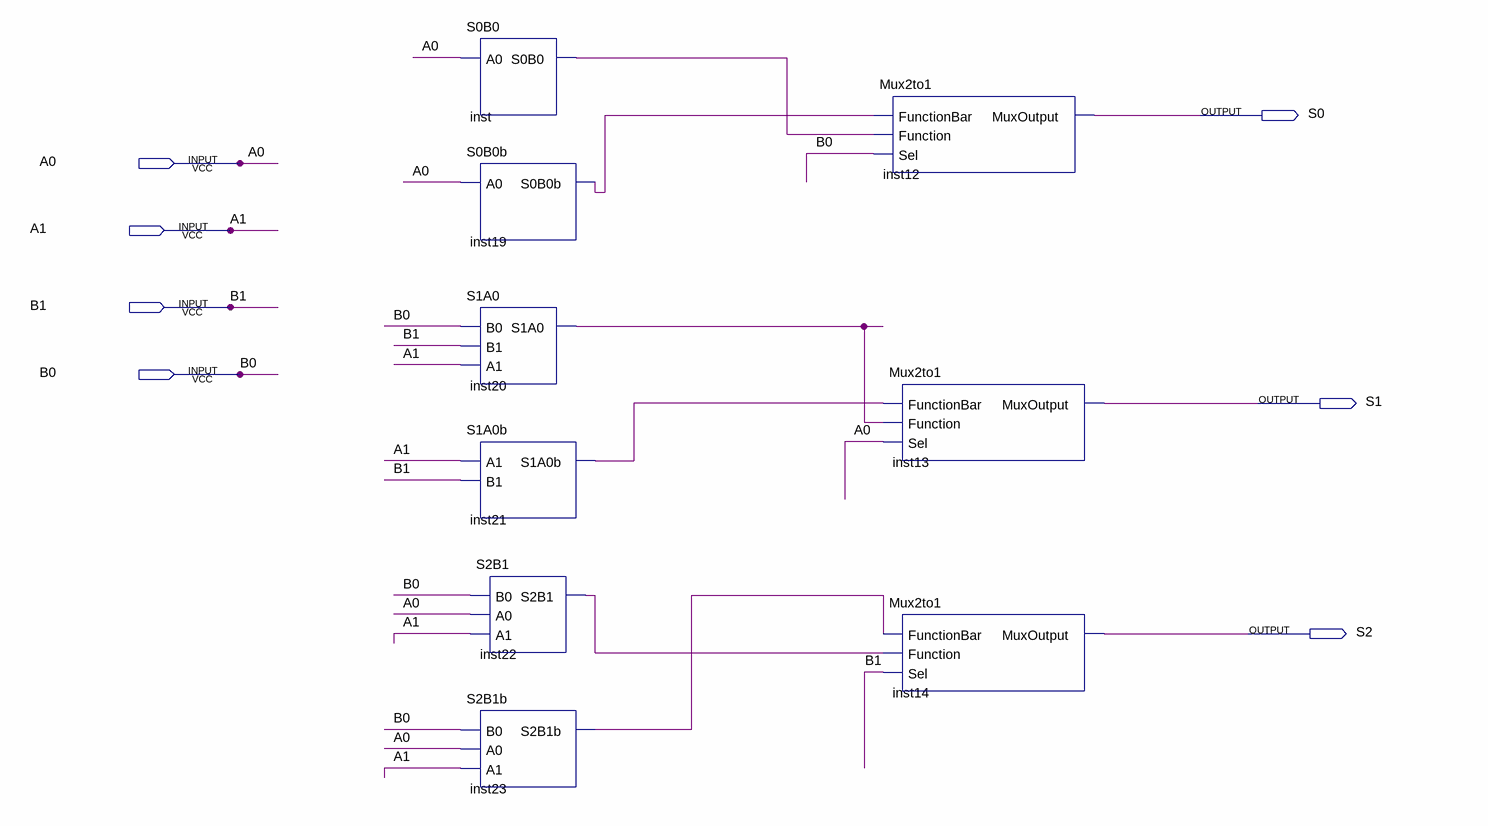
[diagram p0: schematic sheet]
// Quartus schematic Main.bdf as structural Verilog: 9 symbols, 7 pins
module Main (
  input  A0,
  input  A1,
  input  B1,
  input  B0,
  output S0,
  output S1,
  output S2
);

  wire inst19_s0b0b, inst20_s1a0, inst21_s1a0b, inst22_s2b1, inst23_s2b1b, inst_s0b0;

  S0B0 inst (.A0(A0), .S0B0(inst_s0b0));
  S0B0b inst19 (.A0(A0), .S0B0b(inst19_s0b0b));
  S1A0 inst20 (.B0(B0), .B1(B1), .A1(A1), .S1A0(inst20_s1a0));
  S1A0b inst21 (.A1(A1), .B1(B1), .S1A0b(inst21_s1a0b));
  S2B1 inst22 (.B0(B0), .A0(A0), .A1(A1), .S2B1(inst22_s2b1));
  S2B1b inst23 (.B0(B0), .A0(A0), .A1(A1), .S2B1b(inst23_s2b1b));
  Mux2to1 inst12 (.FunctionBar(inst19_s0b0b), .Function(inst_s0b0), .Sel(B0), .MuxOutput(S0));
  Mux2to1 inst13 (.FunctionBar(inst21_s1a0b), .Function(inst20_s1a0), .Sel(A0), .MuxOutput(S1));
  Mux2to1 inst14 (.FunctionBar(inst23_s2b1b), .Function(inst22_s2b1), .Sel(B1), .MuxOutput(S2));
endmodule
